# EAGLE design wifi_lora_gw_v1_1 (EAGLE 7.7.0)
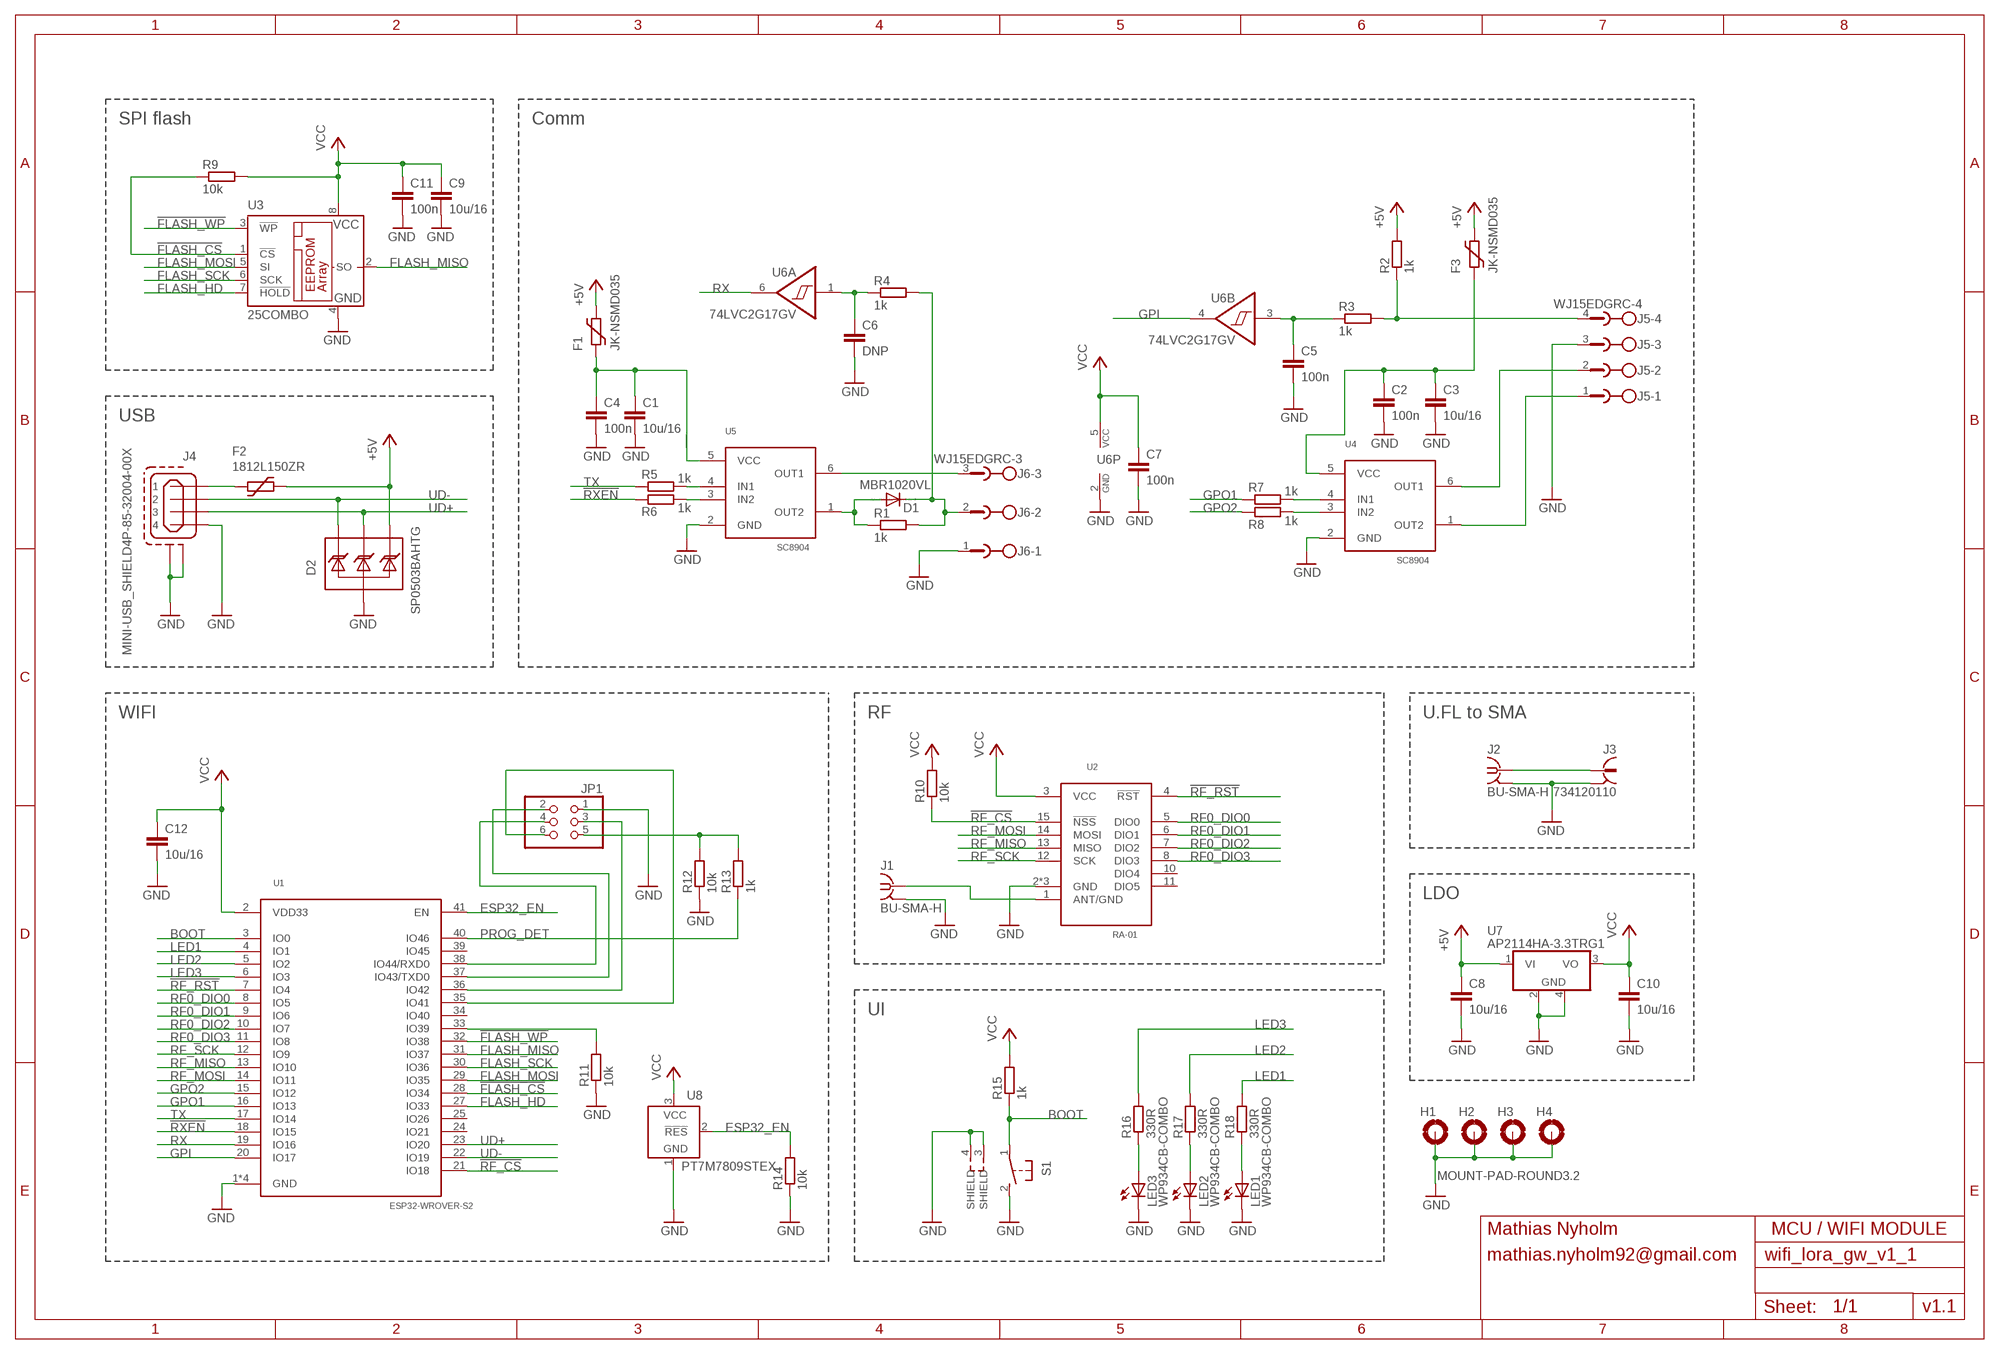
[diagram p0: schematic, sheet 1]

## Parts
C1  10u/16  C-EUC1206  [C1206]
C2  100n  C-EUC0805  [C0805]
C3  10u/16  C-EUC1206  [C1206]
C4  100n  C-EUC0805  [C0805]
C5  100n  C-EUC0805  [C0805]
C6  DNP  C-EUC0805  [C0805]
C7  100n  C-EUC0805  [C0805]
C8  10u/16  C-EUC1206  [C1206]
C9  10u/16  C-EUC1206  [C1206]
C10  10u/16  C-EUC1206  [C1206]
C11  100n  C-EUC0805  [C0805]
C12  10u/16  C-EUC1206  [C1206]
D1  MBR1020VL  DIODE-SOD123  [SOD123]
D2  SP0503BAHTG  [SOT143]
F1  JK-NSMD035  1206L  [1206L]
F2  1812L150ZR  1812L  [1812L]
F3  JK-NSMD035  1206L  [1206L]
H1  MOUNT-PAD-ROUND3.2  [3,2-PAD]
H2  MOUNT-PAD-ROUND3.2  [3,2-PAD]
H3  MOUNT-PAD-ROUND3.2  [3,2-PAD]
H4  MOUNT-PAD-ROUND3.2  [3,2-PAD]
J1  BU-SMA-H  [BU-SMA-H]
J2  BU-SMA-H  [BU-SMA-H]
J3  734120110  [734120110]
J4  MINI-USB_SHIELD4P-85-32004-00X  [85-32004-00X]
J5  WJ15EDGRC-4  [WJ15EDGRC-3.81-4]
J6  WJ15EDGRC-3  [WJ15EDGRC-3.81-3]
JP1  PINHD-2X3  [2X03]
LED1  WP934CB-COMBO  [WP934CB-COMBO]
LED2  WP934CB-COMBO  [WP934CB-COMBO]
LED3  WP934CB-COMBO  [WP934CB-COMBO]
R1  1k  R-EU_R0805  [R0805]
R2  1k  R-EU_R0805  [R0805]
R3  1k  R-EU_R0805  [R0805]
R4  1k  R-EU_R0805  [R0805]
R5  1k  R-EU_R0805  [R0805]
R6  1k  R-EU_R0805  [R0805]
R7  1k  R-EU_R0805  [R0805]
R8  1k  R-EU_R0805  [R0805]
R9  10k  R-EU_R0805  [R0805]
R10  10k  R-EU_R0805  [R0805]
R11  10k  R-EU_R0805  [R0805]
R12  10k  R-EU_R0805  [R0805]
R13  1k  R-EU_R0805  [R0805]
R14  10k  R-EU_R0805  [R0805]
R15  1k  R-EU_R0805  [R0805]
R16  330R  R-EU_R0805  [R0805]
R17  330R  R-EU_R0805  [R0805]
R18  330R  R-EU_R0805  [R0805]
S1  31-XX  [B3F-31XX]
U1  ESP32-WROVER-S2  [ESP32-WROVER-I-S2]
U2  RA-01  RA-02  [RA-02]
U3  25COMBO  [SO-08M-COMBO]
U4  SC8904  [SOT23-6L]
U5  SC8904  [SOT23-6L]
U6  74LVC2G17GV  [SOT23-6L]
U7  AP2114HA-3.3TRG1  MCP1754-DB  [SOT223]
U8  PT7M7809STEX  APX809S-SA  [SOT23B-3]

## Nets
!FLASH_CS: R9.1 U1.28(IO34) U3.1(!CS)
!FLASH_WP: U1.32(IO38) U3.3(!WP)
!RF_CS: R10.1 U1.21(IO18) U2.15(!NSS!)
!RF_RST: U1.7(IO4) U2.4(!RST!)
!RXEN: R6.1 U1.18(IO15)
+5V: C8.1 D2.4(C3) F1.P$2 F2.P$2 F3.P$2 R2.2 U7.1(VI)
BOOT: R15.1 S1.1(P) U1.3(IO0)
ESP32_EN: R14.2 U1.41(EN) U8.2(!RES)
FLASH_HD: U1.27(IO33) U3.7(!HOLD)
FLASH_MISO: U1.31(IO37) U3.2(SO)
FLASH_MOSI: U1.29(IO35) U3.5(SI)
FLASH_SCK: U1.30(IO36) U3.6(SCK)
GND: C1.2 C2.2 C3.2 C4.2 C5.2 C6.2 C7.2 C8.2 C9.2 C10.2 C11.2 C12.2 D2.1(A) H1.B3,2(MOUNT) H2.B3,2(MOUNT) H3.B3,2(MOUNT) H4.B3,2(MOUNT) J1.2(GND) J2.2(GND) J3.S@1 J3.S@2 J3.S@3 J4.4 J4.M1(S1) J4.M2(S2) J5.3 J6.1 JP1.1 LED1.K1(C) LED1.K(C) LED2.K1(C) LED2.K(C) LED3.K1(C) LED3.K(C) R11.1 R12.1 R14.1 S1.2(S) S1.3(SHIELD) S1.4(SHIELD) U1.1(GND) U1.26(GND) U1.42(GND) U1.43(GND) U2.2(GND) U2.9(GND) U2.16(GND) U3.4(GND) U4.2(GND) U5.2(GND) U6.2(P:GND) U7.2(GND) U7.4(GND) U8.1(GND)
GPI: U1.20(IO17) U6.4(B:O)
GPO1: R7.1 U1.16(IO13)
GPO2: R8.1 U1.15(IO12)
LED1: R18.2 U1.4(IO1)
LED2: R17.2 U1.5(IO2)
LED3: R16.2 U1.6(IO3)
N$1: LED1.A LED1.A1(A) R18.1
N$2: JP1.5 R12.2 R13.2
N$3: D1.A R1.1 U5.1(OUT2)
N$4: R5.2 U5.4(IN1)
N$5: F2.P$1 J4.1
N$6: JP1.4 U1.38(IO44/RXD0)
N$7: JP1.3 U1.36(IO42)
N$8: R11.2 U1.33(IO39)
N$9: JP1.6 U1.35(IO41)
N$10: JP1.2 U1.37(IO43/TXD0)
N$11: C1.1 C4.1 F1.P$1 U5.5(VCC)
N$12: D1.C J6.2 R1.2 R4.2
N$13: J5.4 R2.1 R3.2
N$14: J5.2 U4.6(OUT1)
N$15: J5.1 U4.1(OUT2)
N$16: C6.1 R4.1 U6.1(A:I)
N$17: R6.2 U5.3(IN2)
N$18: C5.1 R3.1 U6.3(B:I)
N$19: R7.2 U4.4(IN1)
N$20: LED3.A LED3.A1(A) R16.1
N$21: LED2.A LED2.A1(A) R17.1
N$22: J1.1 U2.1(ANT/GND)
N$23: J2.1 J3.1
N$24: J6.3 U5.6(OUT1)
N$25: C2.1 C3.1 F3.P$1 U4.5(VCC)
N$27: R8.2 U4.3(IN2)
PROG_DET: R13.1 U1.40(IO46)
RF0_DIO0: U1.8(IO5) U2.5(DIO0)
RF0_DIO1: U1.9(IO6) U2.6(DIO1)
RF0_DIO2: U1.10(IO7) U2.7(DIO2)
RF0_DIO3: U1.11(IO8) U2.8(DIO3)
RF_MISO: U1.13(IO10) U2.13(MISO)
RF_MOSI: U1.14(IO11) U2.14(MOSI)
RF_SCK: U1.12(IO9) U2.12(SCK)
RX: U1.19(IO16) U6.6(A:O)
TX: R5.1 U1.17(IO14)
UD+: D2.3(C2) J4.3 U1.23(IO20)
UD-: D2.2(C1) J4.2 U1.22(IO19)
VCC: C7.1 C9.1 C10.1 C11.1 C12.1 R9.2 R10.2 R15.2 U1.2(VDD33) U2.3(VCC) U3.8(VCC) U6.5(P:VCC) U7.3(VO) U8.3(VCC)
Unconnected: U1.24(IO21) U1.25(IO26) U1.34(IO40) U1.39(IO45) U2.10(DIO4) U2.11(DIO5)

## Notes on the sheet
- SPI flash | Comm
- USB
- WIFI | RF | U.FL to SMA
- LDO
- UI
- Mathias Nyholm | MCU / WIFI MODULE
- mathias.nyholm92@gmail.com
- v1.1

## Power pins joined to a net without a drawn wire
GND: J1.3(GND) J1.4(GND) J1.5(GND) J2.3(GND) J2.4(GND) J2.5(GND)

## Library data of the parts
C1-C12 = rcl:C-EU: CAPACITOR, European symbol
D1 = diode:DIODE-: DIODE
D2 = SP0503BAHTG:SP0503BAHTG
F1 F3 = ptc-littlefuse (5):1206L
F2 = ptc-littlefuse (5):1812L
H1-H4 = holes:MOUNT-PAD-ROUND: MOUNTING PAD, round
J1 J2 = sma:BU-SMA-H: FEMALE SMA CONNECTOR Radiall; OC_FARNELL: unknown; OC_NEWARK: unknown
J3 = ufl:734120110: MICRO COAXIAL CONNECTOR RECEPTACLE VERTICAL Source: Data sheet <http://www.molex.com/pdm_docs/sd/734120110_sd.pdf>
J4 = usb_dsp___:MINI-USB_SHIELD4P-: MINI USB 4 Pol. Source: www.cypressindustries.com; OC_FARNELL: unknown; OC_NEWARK: unknown
J5 = WJ15EDGRC:WJ15EDGRC-4
J6 = WJ15EDGRC:WJ15EDGRC-3
JP1 = pinhead:PINHD-2X3: PIN HEADER
LED1-LED3 = WP934CB:WP934CB: Low Current (2mA) LED 3 mm Tinted Diffused Package color RED Source: Data sheet <http://www.farnell.com/datasheets/391100.pdf>
R1-R18 = rcl:R-EU_: RESISTOR, European symbol
S1 = switch-omron (2):31-XX: OMRON SWITCH
U1 = esp32-wrover:ESP32-WROVER-S2
U2 = ra-02:RA-02
U3 = spiflash:25*: Serial EEPROM 4K/ 8K , SPI bus
U4 U5 = SC8904:SC8904
U6 = 74LVC2G17:74LVC2G17
U7 = MCP1754:MCP1754*: 250 mA, 16V, Low Quiescent Current LDO Regulator Source: http://ww1.microchip.com/downloads/en/DeviceDoc/22049b.pdf
U8 = APX809S:APX809S

## Board
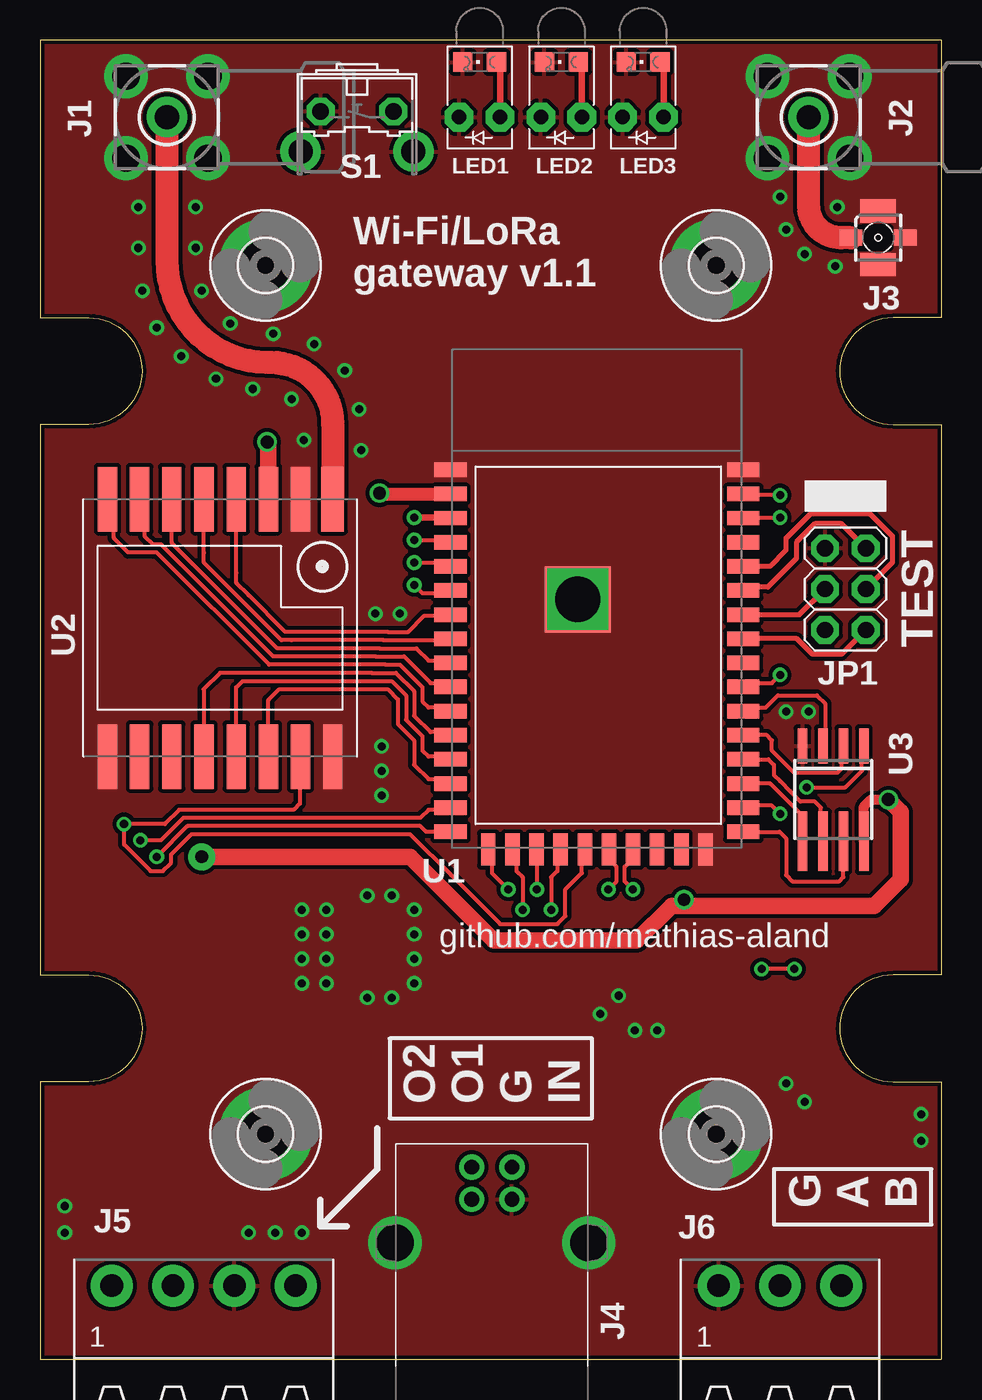
[diagram p1: board, top side]
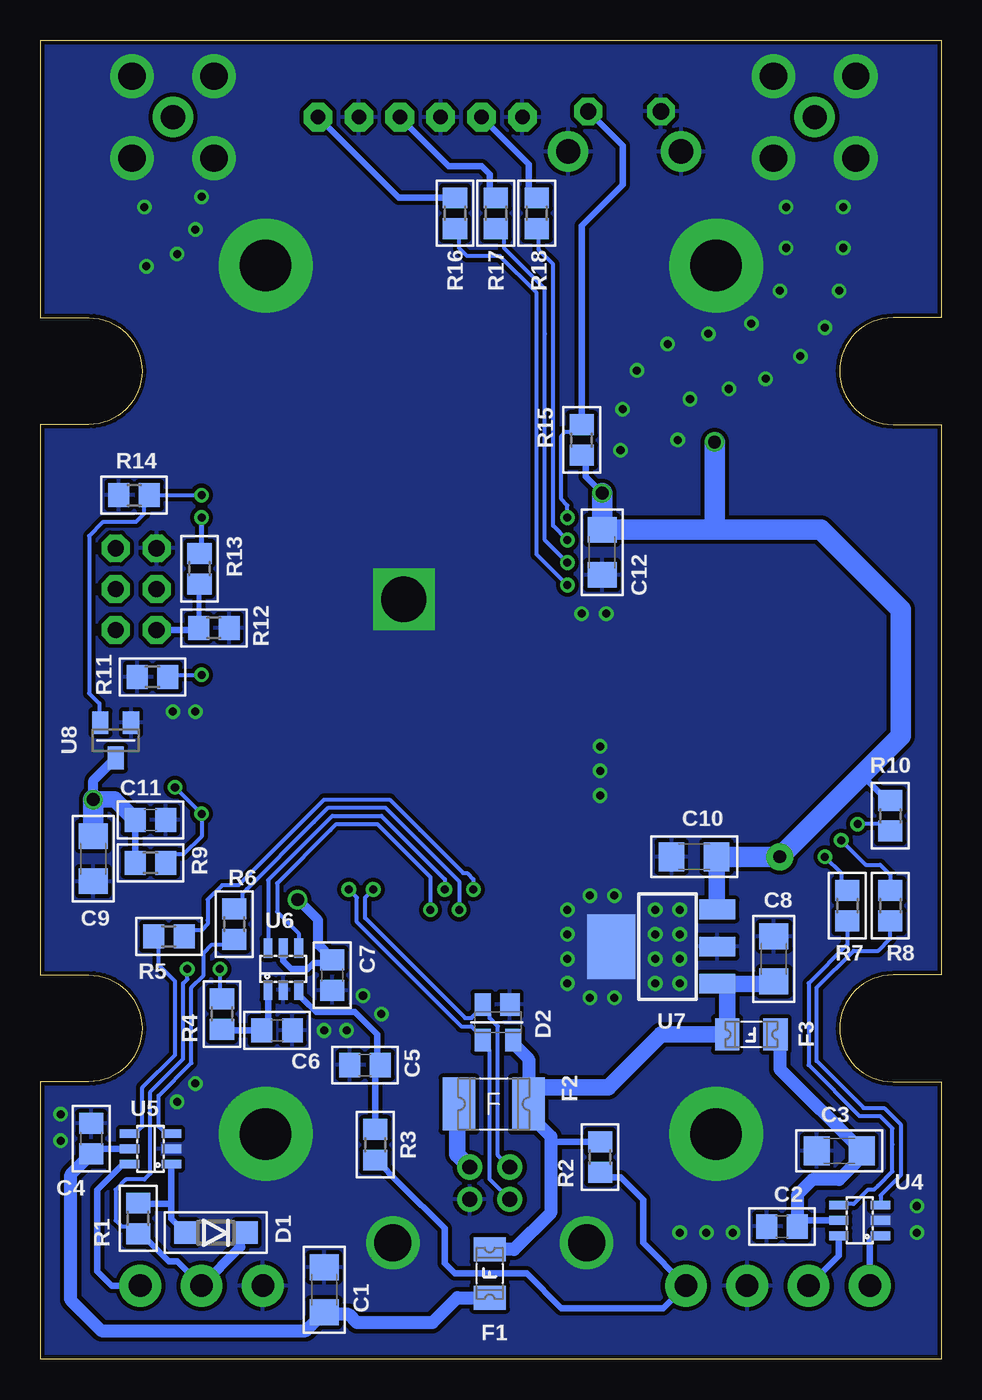
[diagram p2: board, bottom side, seen from below]

Size 56 x 82 mm. Coordinates in mm from the lower left corner, seen from the top.
Outline: 0,0 56,0 56,17.25 52.99,17.25 arc-180 52.99,23.89 56,23.89 56,58.11 52.99,58.11 arc-180 52.99,64.75 56,64.75 56,82 0,82 0,64.75 3,64.75 arc-180 3,58.11 0,58.11 0,23.89 3,23.89 arc-180 3,17.25 0,17.25 0,0
Copper layers (1*16): Top 0.035mm / dielectric 1.6mm / Bottom 0.035mm
Design rules "m_ *": minimum track width 8mil, minimum drill 12mil, track to track 9mil, track to pad 9mil, pad to pad 9mil, via to via 9mil, smd to smd 0mil, copper to edge 10mil, drill to drill 0.5mm, minimum pad ring 12mil, minimum via ring 8mil, stop-mask expansion 2mil, vias tented up to drill 0mil, thermal gap 10mil

### Footprints (pad centres in the part's own frame; a part is rotated, then mirrored left to right if it is on the bottom)
C1206 = smd 1.6 x 1.8: 1 -1.4,0; 2 1.4,0
C0805 = smd 1.3 x 1.5: 1 -0.95,0; 2 0.95,0
SOD123 = smd 1.4 x 1.4: A 1.9,0; C -1.9,0
SOT143 = smd 1.2 x 1.4: 1 -0.75,-1.1 | smd 1 x 1.4: 2 0.95,-1.1; 3 0.95,1.1; 4 -0.95,1.1
1206L = smd 1.5 x 2: P$1 -1.5,0; P$2 1.5,0
1812L = smd 2.03 x 3.3: P$1 -2.16,0; P$2 2.16,0
3,2-PAD = drill 3.2 pad 5.842: B3,2 0,0
BU-SMA-H = drill 1.5: 1 0,0 | drill 1.7: 2 -2.55,2.55; 3 2.55,2.55; 4 2.55,-2.55; 5 -2.55,-2.55
734120110 = smd 1 x 1.4: 1 0,-1.7; S@1 0,1.7 | smd 1.45 x 2.2: S@2 -1.675,0; S@3 1.675,0
85-32004-00X = drill 0.92: 1 4.71,-1.25; 2 4.71,1.25; 3 2.71,1.25; 4 2.71,-1.25 | drill 2.3: M1 0,6.02; M2 0,-6.02
WJ15EDGRC-3.81-4 = drill 1.4 pad 2.6: 1 -5.715,0; 2 -1.905,0; 3 1.905,0; 4 5.715,0
WJ15EDGRC-3.81-3 = drill 1.4 pad 2.6: 1 -3.81,0; 2 0,0; 3 3.81,0
2X03 = drill 1.016 octagon: 1 -2.54,-1.27; 2 -2.54,1.27; 3 0,-1.27; 4 0,1.27; 5 2.54,-1.27; 6 2.54,1.27
WP934CB-COMBO = drill 0.9 pad 1.778 octagon: A 1.27,0; K -1.27,0 | smd 1.2 x 1.2: A1 1.05,3.429; K1 -1.05,3.429
R0805 = smd 1.3 x 1.5: 1 -0.95,0; 2 0.95,0
B3F-31XX = drill 1.016 octagon: 1 -2.261,-1.245; 2 2.261,-1.245 | drill 1.499 pad 2.159: 3 -3.505,1.245; 4 3.505,1.245
ESP32-WROVER-I-S2 = smd 2 x 0.9: 1 -7.91,8.05; 2 -7.91,6.55; 3 -7.91,5.05; 4 -7.91,3.55; 5 -7.91,2.05; 6 -7.91,0.55; 7 -7.91,-0.95; 8 -7.91,-2.45; 9 -7.91,-3.95; 10 -7.91,-5.45; 11 -7.91,-6.95; 12 -7.91,-8.45; 13 -7.91,-9.95; 14 -7.91,-11.45; 15 -7.91,-12.95; 16 -7.91,-14.45; 27 10.29,-14.45; 28 10.29,-12.95; 29 10.29,-11.45; 30 10.29,-9.95; 31 10.29,-8.45; 32 10.29,-6.95; 33 10.29,-5.45; 34 10.29,-3.95; 35 10.29,-2.45; 36 10.29,-0.95; 37 10.29,0.55; 38 10.29,2.05; 39 10.29,3.55; 40 10.29,5.05; 41 10.29,6.55; 42 10.29,8.05 | smd 0.9 x 2: 17 -5.56,-15.55; 18 -4.06,-15.55; 19 -2.56,-15.55; 20 -1.06,-15.55; 21 0.44,-15.55; 22 1.94,-15.55; 23 3.44,-15.55; 24 4.94,-15.55; 25 6.44,-15.55; 26 7.94,-15.55 | smd 4.1 x 4.1: 43 0,0
RA-02 = smd 4 x 1.4: 1 -8,7 | smd 4 x 1.2: 2 -8,5; 3 -8,3; 4 -8,1; 5 -8,-1; 6 -8,-3; 7 -8,-5; 8 -8,-7; 9 8,-7; 10 8,-5; 11 8,-3; 12 8,-1; 13 8,1; 14 8,3; 15 8,5; 16 8,7
SO-08M-COMBO = smd 0.6 x 2.2: 1 -1.905,-3.33; 2 -0.635,-3.33; 3 0.635,-3.33; 4 1.905,-3.33 | smd 0.6 x 3.7: 5 1.905,2.6; 6 0.635,2.6; 7 -0.635,2.6; 8 -1.905,2.6
SOT23-6L = smd 0.55 x 1.2: 1 -0.95,-1.3; 2 0,-1.3; 3 0.95,-1.3; 4 0.95,1.3; 5 0,1.3; 6 -0.95,1.3
SOT223 = smd 1.219 x 2.235: 1 -2.311,-3.099; 2 0,-3.099; 3 2.311,-3.099 | smd 4 x 3: 4 0,3.5
SOT23B-3 = smd 1 x 1.4: 1 -0.95,-1.1; 2 0.95,-1.1; 3 0,1.1

### Placement (x,y rotation side)
C1  38.35,4.32 90 bottom
C2  9.91,8.26 180 bottom
C3  6.35,12.95 180 bottom
C4  52.83,13.72 90 bottom
C5  35.81,18.29 180 bottom
C6  41.27,20.45 0 bottom
C7  37.85,23.88 270 bottom
C8  10.41,24.89 90 bottom
C9  52.7,31.11 270 bottom
C10  15.37,31.24 180 bottom
C11  49.15,33.53 0 bottom
C12  21.08,50.16 270 bottom
D1  45.09,7.87 180 bottom
D2  27.56,20.95 180 bottom
F1  28.07,5.33 90 bottom
F2  27.81,15.88 0 bottom
F3  11.81,20.19 180 bottom
H1  14,68 0 top
H2  42,68 0 top
H3  14,14 0 top
H4  42,14 0 top
J1  7.87,77.22 0 top
J2  47.75,77.22 0 top
J3  52.07,69.72 270 top
J4  28.07,7.24 90 top
J5  10.16,4.57 0 top
J6  45.97,4.57 0 top
JP1  50.04,47.88 270 top
LED1  27.3,77.22 0 top
LED2  32.38,77.22 0 top
LED3  37.47,77.22 0 top
R1  49.91,8.76 270 bottom
R2  21.21,12.57 90 bottom
R3  35.18,13.34 270 bottom
R4  44.7,21.46 90 bottom
R5  48.01,26.29 180 bottom
R6  43.94,27.05 270 bottom
R7  5.84,28.19 270 bottom
R8  3.17,28.19 270 bottom
R9  49.15,30.86 180 bottom
R10  3.17,33.78 90 bottom
R11  49.02,42.42 0 bottom
R12  45.21,45.47 180 bottom
R13  46.1,49.15 270 bottom
R14  50.16,53.72 0 bottom
R15  22.35,57.15 270 bottom
R16  30.23,71.25 270 bottom
R17  27.69,71.25 270 bottom
R18  25.15,71.25 270 bottom
S1  19.68,76.33 180 top
U1  33.4,47.24 0 top
U2  11.18,45.47 270 top
U3  49.28,34.8 180 top
U4  5.08,8.64 90 bottom
U5  49.15,13.08 90 bottom
U6  40.89,24.26 0 bottom
U7  17.02,25.65 90 bottom
U8  51.31,38.48 180 bottom

### Tracks (layer width: path | path; a pad name or v marks a point on that pad's centre or on a via)
!FLASH_CS  (via drill 0.5)
  Top 0.254: v45.97,33.91 45.47,34.42 44.58,34.42 43.81,34.42 U1.28 | v47.62,35.56 50.04,35.56 51.05,36.58 51.05,38 U3.1
  Bottom 0.254: v47.62,35.56 v45.97,33.91 45.97,32.51 47.12,31.37 47.69,31.37 R9.1
!FLASH_WP
  Top 0.254: U1.32 43.91,40.51 45.09,40.51 45.85,41.27 48.26,41.27 48.77,40.77 48.77,38.26 U3.3
!RF_CS  (via drill 0.5)
  Top 0.254: U2.15 16.13,37.42 16.13,34.54 15.75,34.16 8.64,34.16 7.75,33.27 v5.21,33.27 5.21,32 6.86,30.35 7.62,30.35 8.13,30.86 8.13,31.37 9.4,32.64 22.99,32.64 25.53,30.1 28.57,27.05 32.13,27.05 32.64,27.56 32.64,29.21 33.66,30.23 33.66,31.51 U1.21
  Bottom 0.254: R10.1 3.62,33.27 v5.21,33.27
!RF_RST
  Top 0.254: U2.4 12.19,53.45 12.19,48.9 12.19,48.26 12.95,47.5 15.24,45.21 15.88,45.21 21.59,45.21 22.86,45.21 23.88,46.23 25.43,46.23 U1.7
!RXEN  (via drill 0.5)
  Top 0.254: U1.18 29.59,31.44 29.59,30.35 29.97,29.97 v29.97,27.94
  Bottom 0.254: v29.97,27.94 29.97,29.72 34.54,34.29 38.1,34.29 38.99,33.4 43.18,29.21 43.43,28.96 43.43,28.45 43.88,28 R6.1
+5V
  Bottom 0.406: R2.2 24.2,13.52 24.26,13.46
  Bottom 0.813: D2.4 26.61,19.62 25.65,18.67 25.65,16.89 F2.P$2 25.65,15.24 24.26,13.84 24.26,13.46 24.26,9.14 26.57,6.83 F1.P$2
  Bottom 1.016: 25.65,16.89 20.7,16.89 17.4,20.19 F3.P$2 13.31,23.34 U7.1 10.56,23.34 C8.1
BOOT  (via drill 0.5)
  Top 0.406: U1.3 25.46,52.32 v23.24,52.32
  Bottom 0.254: v23.24,52.32 23.24,53.09 23.62,53.47 23.62,57.4 23.37,57.66 22.79,57.66 R15.1
  Bottom 0.406: S1.1 19.81,75.44 19.81,73.03 22.35,70.48 22.35,61.21 R15.1
ESP32_EN  (via drill 0.5)
  Top 0.254: v45.97,53.72 43.69,53.72 U1.41
  Bottom 0.254: U8.2 52.32,39.65 52.32,40.77 52.96,41.4 52.96,51.18 52.07,52.07 50.04,52.07 49.53,52.58 49.53,53.41 R14.2 v45.97,53.72
FLASH_HD
  Top 0.254: U1.27 45.95,32.79 46.35,32.38 46.35,30.1 46.74,29.72 49.66,29.72 49.91,29.97 U3.7
FLASH_MISO
  Top 0.254: U3.2 49.78,38 49.78,36.7 49.53,36.45 48.77,36.45 46.86,36.45 45.59,37.72 45.47,37.85 45.47,38.48 45.15,38.79 U1.31
FLASH_MOSI
  Top 0.254: U3.5 47.37,33.78 46.1,35.05 45.36,35.79 U1.29
FLASH_SCK
  Top 0.254: U1.30 45.26,37.29 45.59,36.96 45.59,36.32 45.97,35.94 46.61,35.31 47.24,34.67 48.13,34.67 48.51,34.29 48.51,32.33 U3.6
GND  (via drill 0.5 pad 0.9, 2.8 pad 3.8)
  other vias: 33.4,47.24 36.96,20.45 38.35,20.45 23.24,27.94 16.26,23.37 17.78,24.89 17.78,23.37 16.26,24.89 17.78,27.94 16.26,27.94 16.26,26.42 17.78,26.42 46.35,40.26 47.75,40.26 35.94,22.61 34.8,21.46 23.24,26.42 23.24,24.89 21.84,28.83 20.32,28.83 23.24,23.37 21.84,22.48 20.32,22.48 21.21,35.05 21.21,36.58 21.21,38.1 20.83,46.35 22.35,46.35 6.1,71.63 6.1,69.09 6.35,66.42 7.24,64.14 8.76,62.36 10.92,60.96 13.21,60.33 15.62,59.69 16.38,57.15 19.81,59.05 19.94,56.52 18.92,61.47 17.02,63.12 14.48,63.75 9.65,71.63 9.65,69.09 10.03,66.42 11.81,64.39 45.97,72.26 46.35,70.23 47.5,68.71 49.4,67.94 49.53,71.63 54.74,15.24 54.74,13.59 1.52,9.53 1.52,7.87 47.5,16 46.35,17.14 12.95,7.87 14.61,7.87 16.26,7.87
  pour Top (isolate 0.254, rank 6): 0,0 56.61,0 56.61,82.66 0,82.66
  pour Bottom (isolate 0.254, rank 6): 0,0 56.61,0 56.61,82.66 0,82.66
  pour Bottom (isolate 0.254, no thermals): 36.2,50.04 30.61,50.04 30.61,44.45 36.2,44.45
  pour Top (isolate 0.254, no thermals): 30.61,50.04 36.2,50.04 36.2,44.45 30.61,44.45
  pour Top (isolate 0.254, no thermals): 15.24,56.01 17.14,56.01 17.14,50.93 15.24,50.93
  pour Top (isolate 0.254, no thermals): 10.41,71.63 18.03,71.63 18.03,64.52 10.41,64.52
  pour Top (isolate 0.254, no thermals): 38.1,71.63 45.72,71.63 45.72,64.52 38.1,64.52
  pour Top (isolate 0.254, no thermals): 10.16,17.65 17.78,17.65 17.78,10.54 10.16,10.54
  pour Top (isolate 0.254, no thermals): 38.1,17.53 45.72,17.53 45.72,10.41 38.1,10.41
  pour Top (isolate 0.254, no thermals): 19.81,9.53 24.26,9.53 24.26,4.95 19.81,4.95
  pour Top (isolate 0.254, no thermals): 31.88,9.53 36.32,9.53 36.32,4.95 31.88,4.95
  pour Top (isolate 0.254, no thermals): 3.43,81.53 12.57,81.53 12.57,72.64 3.43,72.64
  pour Top (isolate 0.254, no thermals): 43.18,81.53 52.32,81.53 52.32,72.64 43.18,72.64
  pour Bottom (isolate 0.254, no thermals): 12.57,81.53 3.43,81.53 3.43,72.64 12.57,72.64
  pour Bottom (isolate 0.254, no thermals): 52.32,81.53 43.18,81.53 43.18,72.64 52.32,72.64
  pour Bottom (isolate 0.254, no thermals): 45.72,71.63 38.1,71.63 38.1,64.52 45.72,64.52
  pour Bottom (isolate 0.254, no thermals): 18.03,71.63 10.41,71.63 10.41,64.52 18.03,64.52
  pour Bottom (isolate 0.254, no thermals): 24.26,9.53 19.81,9.53 19.81,4.95 24.26,4.95
  pour Bottom (isolate 0.254, no thermals): 36.32,9.53 31.88,9.53 31.88,4.95 36.32,4.95
  pour Bottom (isolate 0.254, no thermals): 45.72,17.53 38.1,17.53 38.1,10.41 45.72,10.41
  pour Bottom (isolate 0.254, no thermals): 17.78,17.65 10.16,17.65 10.16,10.54 17.78,10.54
  pour Top (isolate 0.254, no thermals): 50.42,72.52 54.99,72.52 54.99,66.93 50.42,66.93
  pour Bottom (isolate 0.254, no thermals): 23.5,28.45 17.91,28.45 17.91,22.86 23.5,22.86
  pour Bottom (isolate 0.254, no thermals): 48.39,14.1 45.85,14.1 45.85,11.94 48.39,11.94
  pour Bottom (isolate 0.254, no thermals): 4.83,9.65 1.27,9.65 1.27,7.49 4.83,7.49
  pour Top (isolate 0.254, no thermals): 42.16,56.64 45.09,56.64 45.09,54.48 42.16,54.48
  pour Top (isolate 0.254, no thermals): 24,56.64 26.92,56.64 26.92,54.48 24,54.48
  pour Top (isolate 0.254, no thermals): 40.13,30.23 40.13,33.15 42.29,33.15 42.29,30.23
  pour Top (isolate 0.254, no thermals): 3.17,40.01 5.08,40.01 5.08,34.92 3.17,34.92
  pour Top (isolate 0.254, no thermals): 17.27,40.01 19.18,40.01 19.18,34.92 17.27,34.92
GPI  (via drill 0.5)
  Top 0.254: U1.20 32.13,31.48 32.13,30.35 31.75,29.97 v31.75,27.94
  Bottom 0.254: U6.4 39.94,26.48 41.27,27.81 41.27,29.59 37.97,32.89 37.59,33.27 35.05,33.27 31.75,29.97 v31.75,27.94
GPO1  (via drill 0.5)
  Top 0.254: 25.49,32.77 U1.16 23.98,32.79 23.62,33.15 9.14,33.15 v7.24,31.24
  Bottom 0.254: v7.24,31.24 6.22,30.23 6.22,29.59 5.84,29.21 R7.1
GPO2  (via drill 0.5)
  Top 0.254: U1.15 25.36,34.16 24.13,34.16 23.62,33.66 9.14,33.66 8.89,33.66 8.38,33.15 7.49,32.26 v6.22,32.26
  Bottom 0.254: v6.22,32.26 4.7,30.73 3.81,30.73 3.17,30.1 R8.1
LED1  (via drill 0.5)
  Top 0.254: v23.24,50.93 25.36,50.93 U1.4
  Bottom 0.254: v23.24,50.93 24.13,51.82 24.13,53.09 24.13,64.01 24.13,68.07 25.02,68.96 25.02,70.17 R18.2
LED2  (via drill 0.5)
  Top 0.254: v23.24,49.53 25.25,49.53 U1.5
  Bottom 0.254: v23.24,49.53 24.64,50.93 24.64,63.75 24.64,66.55 27.18,69.09 27.18,69.79 R17.2
LED3  (via drill 0.5)
  Top 0.254: v23.24,48.13 23.75,47.62 24.64,47.62 25.32,47.62 U1.6
  Bottom 0.254: v23.24,48.13 25.15,50.04 25.15,63.5 25.15,66.29 27.43,68.58 29.46,68.58 29.97,69.09 29.97,70.04 R16.2
N$1
  Top 0.406: LED1.A 28.57,80.64 LED1.A1
  Bottom 0.406: R18.1 25.21,72.2 25.65,72.64 25.65,74.3 LED1.A
N$2
  Bottom 0.305: R13.2 46.16,48.14 R12.2
  Bottom 0.406: JP1.5 46.16,45.34 R12.2
N$3
  Bottom 0.406: U5.1 47.85,9.65 | 47.85,9.65 47.85,8.74 D1.A | R1.1 49.85,9.65 47.85,9.65
N$4
  Bottom 0.254: U5.4 50.1,14.03 49.66,14.48 49.66,16.89 47.62,18.92 47.62,23.5 48.64,24.51 48.64,25.97 R5.2
N$5
  Bottom 1.016: J4.1 30.1,12.73 30.1,15.75 F2.P$1
N$6
  Top 0.305: JP1.4 52.96,49.53 52.96,51.18 51.56,52.58 47.88,52.58 46.35,51.05 46.35,50.29 45.36,49.29 U1.38
N$7
  Top 0.305: U1.36 47.18,46.29 JP1.3
N$8  (via drill 0.5)
  Top 0.254: U1.33 43.93,42.04 45.47,42.04 v45.97,42.55
  Bottom 0.254: R11.2 47.95,42.55 v45.97,42.55
N$9
  Top 0.305: JP1.6 49.78,43.81 48.01,43.81 47.03,44.79 U1.35
N$10
  Top 0.305: JP1.2 49.78,51.94 48.13,51.94 46.99,50.8 46.99,49.78 45.21,48.01 43.9,48.01 U1.37
N$11
  Bottom 0.406: U5.5 52.52,13.08 C4.1
  Bottom 0.813: C4.1 54.1,11.5 54.1,3.68 52.2,1.78 39.49,1.78 C1.1 38.23,2.79 36.83,2.79 36.32,2.28 31.63,2.28 30.07,3.83 F1.P$1
N$12  (via drill 0.5)
  Top 0.254: v46.86,24.26 v44.83,24.26
  Bottom 0.254: v46.86,24.26 46.86,23.62 47.12,23.37 47.12,18.67 49.15,16.64 49.15,11.56 49.53,11.18 50.67,11.18 51.31,10.54 51.31,8.64 50.93,8.26 50.35,8.26 R1.2 | v44.83,24.26 44.83,22.54 R4.2
  Bottom 0.406: J6.2 47.5,6.1 48.01,6.1 49.72,7.81 R1.2
  Bottom 0.61: J6.2 43.56,6.99 43.56,7.49 D1.C
N$13
  Bottom 0.406: R2.1 20.89,11.3 20.7,11.3 19.94,11.3 18.54,9.91 18.54,7.24 J5.4 17.27,3.17 23.62,3.17 25.78,5.33 27.18,5.33 30.23,5.33 30.86,5.97 30.86,8.13 33.66,10.92 35.12,12.38 R3.2
N$14
  Bottom 0.406: J5.2 6.38,6.45 U4.6
N$15
  Bottom 0.406: U4.1 4.12,7.69 4.45,7.37 J5.1
N$16
  Bottom 0.406: U6.1 41.84,20.83 C6.1 44.64,20.45 R4.1
N$17
  Bottom 0.254: U5.3 48.19,14.03 48.64,14.48 48.64,16.38 46.61,18.41 46.61,23.11 45.85,23.88 45.85,25.27 45.34,25.78 44.26,25.78 R6.2
N$18
  Bottom 0.406: U6.3 39.94,22.67 39.62,22.35 38.86,21.59 37.97,21.59 36.45,21.59 35.05,20.19 35.05,18.54 34.86,18.35 C5.1 35.18,17.97 R3.1
N$19
  Bottom 0.254: R7.2 5.84,25.78 8.26,23.37 8.26,18.29 5.08,15.11 3.81,15.11 3.05,14.35 3.05,13.34 3.05,11.68 3.94,10.79 4.19,10.54 4.57,10.54 5.46,9.65 5.84,9.65 6.31,9.65 U4.4
N$20
  Top 0.406: LED3.A 38.73,80.64 LED3.A1
  Bottom 0.406: R16.1 33.72,72.2 LED3.A
N$21
  Top 0.406: LED2.A 33.66,80.64 LED2.A1
  Bottom 0.406: R17.1 27.75,72.2 28.07,72.52 28.07,73.66 28.57,74.17 30.61,74.17 LED2.A
N$22
  Top 1.422: J1.1 7.87,68.33 arc90 14.1,61.98 14.35,61.98 arc-90 18.18,58.15 U2.1
N$23
  Top 1.422: J3.1 49.75,69.72 arc-90 47.75,71.72 J2.1
N$24
  Bottom 0.406: U5.6 50.86,12.13 51.69,11.3 52.45,10.54 52.45,8 52.45,5.46 51.56,4.57 J6.3
N$25
  Bottom 0.406: U4.5 8.57,8.64 C2.1
  Bottom 0.813: F3.P$1 10.03,19.91 10.03,18.03 C3.1 | C3.1 | C3.1 4.95,12.57 6.35,11.18 8,11.18 8.96,10.22 C2.1
N$27
  Bottom 0.254: R8.2 3.17,26.16 3.94,25.4 5.46,25.4 7.75,23.11 7.75,18.54 4.83,15.62 3.56,15.62 2.54,14.61 2.54,11.43 3.17,10.79 3.78,10.19 U4.3
PROG_DET  (via drill 0.5)
  Top 0.254: U1.40 43.72,52.32 v45.97,52.32
  Bottom 0.305: R13.1 45.97,50.23 v45.97,52.32
RF0_DIO0
  Top 0.254: U2.5 10.18,50.15 10.18,49.51 11.94,47.75 14.99,44.7 15.62,44.7 21.34,44.7 25.4,44.7 U1.8
RF0_DIO1
  Top 0.254: U2.6 8.18,50.75 14.73,44.2 21.08,44.2 23.37,44.2 24.13,43.43 25.35,43.43 U1.9
RF0_DIO2
  Top 0.254: U2.7 6.48,53.16 6.48,51.18 6.99,50.67 7.49,50.67 14.48,43.69 20.83,43.69 22.61,43.69 24.26,42.04 25.25,42.04 U1.10
RF0_DIO3
  Top 0.254: U1.11 25.27,40.51 24.13,40.51 23.75,40.89 23.75,41.78 23.5,42.04 22.35,43.18 21.46,43.18 14.22,43.18 7.24,50.16 6.35,50.16 5.46,50.16 4.57,51.05 4.57,53.07 U2.8
RF_MISO
  Top 0.254: U1.13 25.32,37.47 24.13,37.47 23.75,37.85 23.75,38.73 22.73,39.75 22.73,41.27 21.84,42.16 20.45,42.16 12.57,42.16 12.18,41.77 U2.13
RF_MOSI
  Top 0.254: U2.14 14.18,40.97 14.86,41.66 20.32,41.66 21.59,41.66 22.23,41.02 22.23,39.5 23.24,38.48 23.24,36.96 24.13,36.07 25.22,36.07 U1.14
RF_SCK
  Top 0.254: U1.12 25.3,38.99 24.26,38.99 23.24,40.01 23.24,41.53 22.1,42.67 20.57,42.67 19.68,42.67 11.18,42.67 10.16,41.66 10.16,37.48 U2.12
RX  (via drill 0.5)
  Top 0.254: U1.19 30.86,31.67 v30.86,29.21
  Bottom 0.254: U6.6 41.84,29.78 37.85,33.78 34.8,33.78 30.86,29.84 v30.86,29.21
TX  (via drill 0.5)
  Top 0.254: U1.17 28.07,31.47 28.07,30.23 v29.08,29.21
  Bottom 0.254: v29.08,29.21 29.08,29.84 29.46,30.23 29.72,30.23 32.38,32.89 34.29,34.8 34.54,34.8 38.35,34.8 39.5,33.66 43.31,29.84 43.69,29.46 44.7,29.46 45.59,28.57 45.59,27.3 45.59,27.05 45.97,26.67 46.74,26.67 47.06,26.35 R5.1
UD+  (via drill 0.5)
  Top 0.254: v36.83,29.21 36.32,29.72 36.32,30.1 36.32,30.61 36.84,31.13 U1.23
  Bottom 0.254: J4.3 28.07,11.2 28.07,19.18 28.51,19.62 D2.3 28.51,20 29.21,20.7 29.84,20.7 36.32,27.18 36.32,28.7 v36.83,29.21
UD-  (via drill 0.5)
  Top 0.254: v35.31,29.21 35.81,29.72 35.81,30.35 35.81,30.61 35.34,31.08 U1.22
  Bottom 0.254: J4.2 27.56,12.69 27.56,20.7 28.07,21.21 28.07,21.46 28.51,21.91 D2.2 28.51,21.91 29.21,21.21 29.59,21.21 35.81,27.43 35.81,28.7 v35.31,29.21
VCC  (via drill 0.8, 0.8 pad 1.68)
  Top 0.61: U3.8 51.18,34.36 51.62,34.8 v52.7,34.8
  Top 0.813: v21.08,53.85 21.14,53.79 U1.2
  Top 1.016: v52.7,34.8 53.47,34.04 53.47,29.84 51.82,28.19 40.01,28.19 | v10.03,31.24 22.99,31.24 28.19,26.04 37.08,26.04 39.24,28.19 40.01,28.19 | U2.3 14.18,56.94 v14.1,57.02 | v40.01,28.57 40.01,28.19
  Bottom 0.406: R9.2 C11.1 | 20.95,53.98 v21.08,53.85 22.1,54.86 22.1,55.95 R15.2 | U6.5 40.89,24.77 40.39,24.26 39.37,24.26 38.99,24.64 38.03,24.64 C7.1 | R10.2 3.36,34.73 4.95,36.32
  Bottom 0.61: v52.7,34.8 52.7,35.98 U8.3 | C7.1 37.85,24.89 38.73,25.78 38.73,27.3 v40.01,28.57
  Bottom 1.016: v52.7,34.8 51.37,34.8 C11.1 | C10.1 13.97,27.96 U7.3
  Bottom 1.27: C10.1 | C10.1 | v21.08,53.85 C12.1 14.1,51.56 | 14.1,51.56 7.5,51.56 2.54,46.61 2.54,38.73 4.95,36.32 v10.03,31.24 C10.1 | v14.1,57.02 14.1,51.56 | C9.1 v52.7,34.8

### Text on the board
tPlace: Wi-Fi/LoRa / gateway v1.1 | TEST | github.com/mathias-aland | O2 / O1 / G / IN | G / A / B
_tsilk: Q1-3 | +PWR | MAX 250V 16A | NTC | +SENSE | BOOT0 | I/O | RELAY | CONT. | ISO. I/O | FP
_bsilk: 2015-01-29 | Mathias Nyholm | mathias.nyholm92@gmail.com